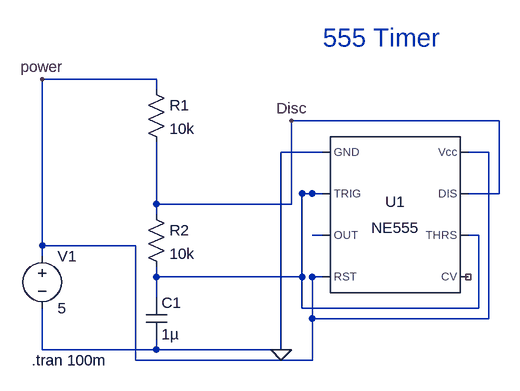
[diagram p0: schematic 555-timer.asc]
555-timer.asc, the LTspice schematic file:
Version 4.1
SHEET 1 880 680
WIRE -48 368 -48 384
WIRE 208 80 192 80
WIRE -224 320 -224 336
WIRE -48 384 -224 384
WIRE -224 384 -224 336
WIRE -48 384 144 384
WIRE 144 384 144 80
WIRE 144 80 192 80
FLAG 144 384 0
WIRE -48 64 -48 80
WIRE -48 176 -48 160
WIRE 432 144 448 144
WIRE -48 80 -48 160
WIRE -48 160 160 160
WIRE 160 160 160 32
WIRE 160 32 480 32
WIRE 480 32 480 144
WIRE 480 144 448 144
FLAG 160 32 Disc
WIRE -48 304 -48 288
WIRE -48 256 -48 272
WIRE 208 144 192 144
WIRE 432 208 448 208
WIRE -48 288 -48 272
WIRE -48 272 176 272
WIRE 176 272 176 144
WIRE 176 144 192 144
WIRE 192 144 176 144
WIRE 176 144 176 320
WIRE 176 320 448 320
WIRE 448 320 448 208
WIRE 208 208 192 208
WIRE -48 -16 -48 -32
WIRE 208 272 192 272
WIRE 432 80 448 80
WIRE -224 240 -224 224
WIRE -48 -32 -224 -32
WIRE -224 -32 -224 224
WIRE -224 224 -80 224
WIRE -80 224 -80 400
WIRE -80 400 192 400
WIRE 192 400 192 272
WIRE 192 272 192 336
WIRE 192 336 464 336
WIRE 464 336 464 80
WIRE 464 80 448 80
FLAG -224 -32 power
SYMBOL Misc\\NE555 320 176 R0
SYMATTR InstName U1
SYMBOL res -64 -32 R0
SYMATTR InstName R1
SYMATTR Value 10k
SYMBOL res -64 160 R0
SYMATTR InstName R2
SYMATTR Value 10k
SYMBOL cap -64 304 R0
SYMATTR InstName C1
SYMATTR Value 1µ
SYMBOL voltage -224 224 R0
WINDOW 123 0 0 Left 2
WINDOW 39 0 0 Left 2
SYMATTR InstName V1
SYMATTR Value 5
TEXT -240 400 Left 2 !.tran 100m
TEXT 208 -96 Left 4 ;555 Timer

The netlist it stands for:
* 555-timer.asc
X§U1 0 N001 N002 power NC_01 N001 Disc power NE555  ; pins GND TRIG OUT RST CV THRS DIS Vcc
R1 power Disc 10k
R2 Disc N001 10k
C1 N001 0 1µ
V1 power 0 5
.tran 100m
* 555 Timer
.lib NE555.sub
.backanno
.end